# EAGLE design LED (EAGLE 9.6.2)
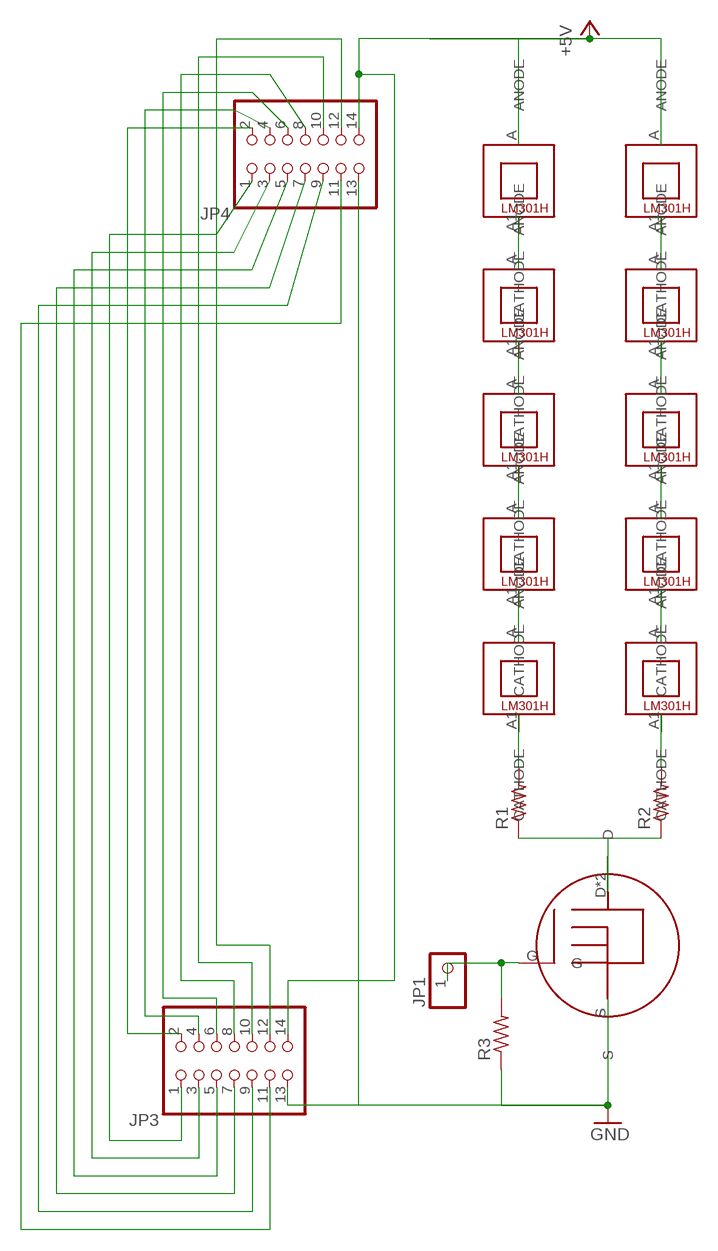
[diagram p0: schematic, sheet 1]

## Parts
JP1  PINHD-1X1  [1X01]
JP3  PINHD-2X7  [2X07]
JP4  PINHD-2X7  [2X07]
R1  FLIPFLOP-RES  [0805-THM]
R2  FLIPFLOP-RES  [0805-THM]
R3  FLIPFLOP-RES  [0805-THM]
U$1  LM301H  [SPMWHD32AMH5XAT5SL]
U$2  LM301H  [SPMWHD32AMH5XAT5SL]
U$3  LM301H  [SPMWHD32AMH5XAT5SL]
U$4  LM301H  [SPMWHD32AMH5XAT5SL]
U$5  LM301H  [SPMWHD32AMH5XAT5SL]
U$6  LM301H  [SPMWHD32AMH5XAT5SL]
U$7  LM301H  [SPMWHD32AMH5XAT5SL]
U$8  LM301H  [SPMWHD32AMH5XAT5SL]
U$9  LM301H  [SPMWHD32AMH5XAT5SL]
U$10  LM301H  [SPMWHD32AMH5XAT5SL]
U$11  SOT223  [S]

## Nets
_GND: R1.1 R2.1 U$11.D U$11.DKLEIN(D)
GND: JP3.13 JP4.13 R3.1 U$11.S
N$1: JP3.12 JP4.12
N$2: JP3.1 JP4.1
N$3: R2.2 U$10.A1(CATHODE)
N$4: U$9.A1(CATHODE) U$10.A(ANODE)
N$5: U$8.A1(CATHODE) U$9.A(ANODE)
N$6: U$7.A1(CATHODE) U$8.A(ANODE)
N$7: U$6.A1(CATHODE) U$7.A(ANODE)
N$8: R1.2 U$5.A1(CATHODE)
N$9: U$4.A1(CATHODE) U$5.A(ANODE)
N$10: U$3.A1(CATHODE) U$4.A(ANODE)
N$11: U$2.A1(CATHODE) U$3.A(ANODE)
N$12: U$1.A1(CATHODE) U$2.A(ANODE)
N$13: JP3.2 JP4.2
N$14: JP3.3 JP4.3
N$15: JP3.4 JP4.4
N$16: JP3.5 JP4.5
N$17: JP3.6 JP4.6
N$18: JP3.7 JP4.7
N$19: JP3.8 JP4.8
N$20: JP3.9 JP4.9
N$21: JP3.10 JP4.10
N$22: JP3.11 JP4.11
N$23: JP1.1 R3.2 U$11.G
VCC: JP3.14 JP4.14 U$1.A(ANODE) U$6.A(ANODE) ; supply symbol labelled +5V

## Library data of the parts
JP1 = pinhead:PINHD-1X1: PIN HEADER
JP3 JP4 = pinhead:PINHD-2X7: PIN HEADER
R1-R3 = adafruit:FLIPFLOP-RES: Flip Flop resistor An 0805 resistor inside a standard 1/4W 5% resistor. Makes for easy mods
U$1-U$10 = Samsung LEDs:LM301H
U$11 = FRUGT:SOT223

## Board
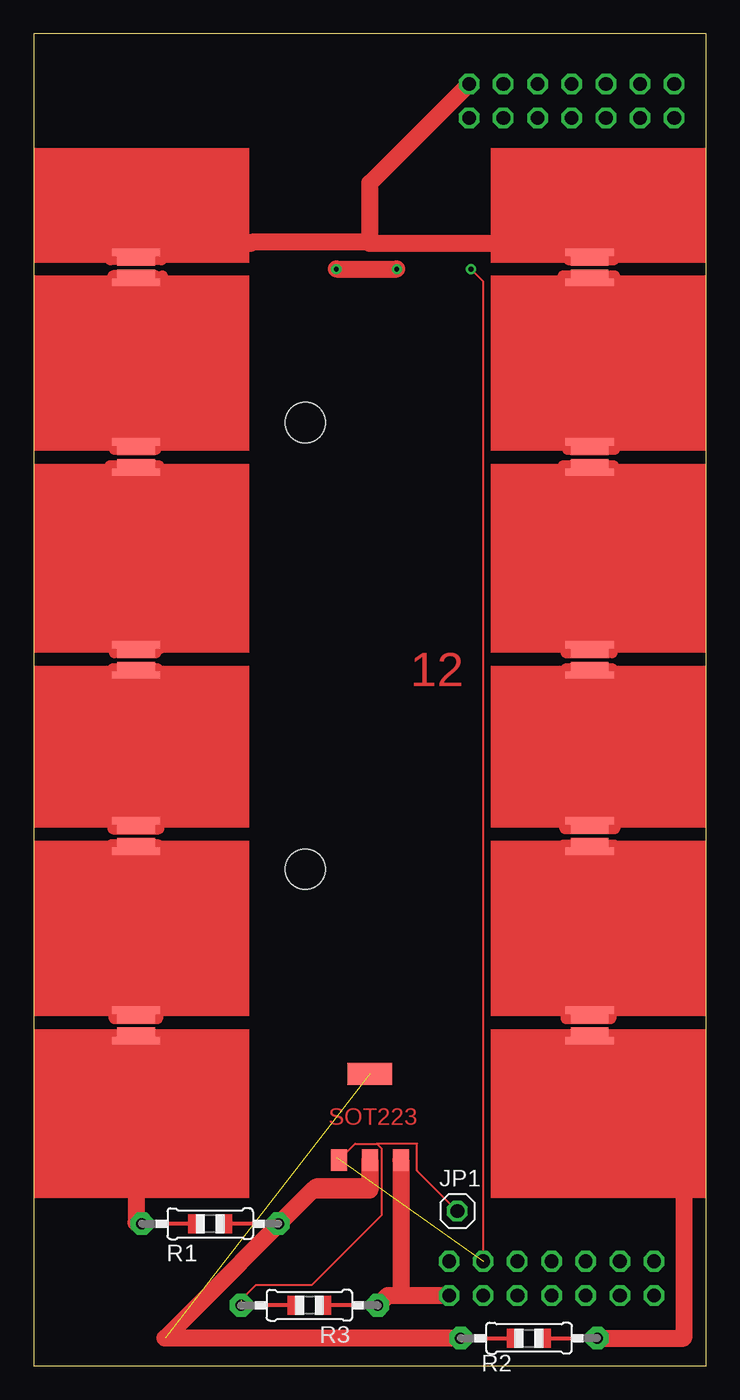
[diagram p1: board, top side]
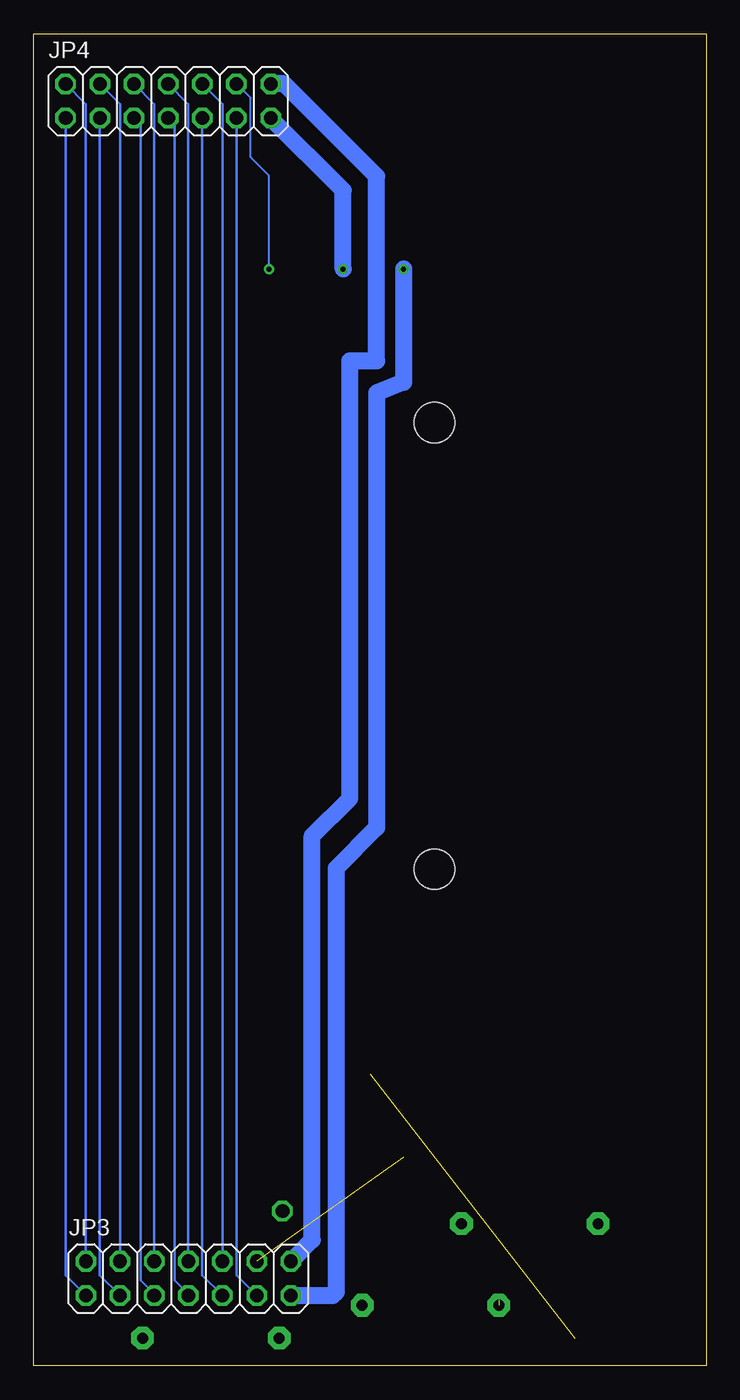
[diagram p2: board, bottom side, seen from below]

Size 50 x 99 mm. Coordinates in mm from the lower left corner, seen from the top.
Outline: 0,0 50,0 50,99 0,99 0,0
Copper layers (1*16): Top 0.035mm / dielectric 1.5mm / Bottom 0.035mm
Design rules "default": minimum track width 6mil, minimum drill 0.35mm, track to track 6mil, track to pad 6mil, pad to pad 6mil, via to via 6mil, smd to smd 6mil, copper to edge 40mil, drill to drill 6mil, minimum pad ring 10mil, minimum via ring 8mil, stop-mask expansion 4mil, vias tented up to drill 0mil, thermal gap 10mil
Holes 3 mm at 20.2,70.1 20.2,36.9

### Footprints (pad centres in the part's own frame; a part is rotated, then mirrored left to right if it is on the bottom)
1X01 = drill 1.016 octagon: 1 0,0
2X07 = drill 1.016 octagon: 1 -7.62,-1.27; 2 -7.62,1.27; 3 -5.08,-1.27; 4 -5.08,1.27; 5 -2.54,-1.27; 6 -2.54,1.27; 7 0,-1.27; 8 0,1.27; 9 2.54,-1.27; 10 2.54,1.27; 11 5.08,-1.27; 12 5.08,1.27; 13 7.62,-1.27; 14 7.62,1.27
0805-THM = drill 0.813 pad 1.676 octagon: 1 -5.08,0; 2 5.08,0
SPMWHD32AMH5XAT5SL = smd 3.6 x 0.55: A -3.81,2.475; A1 -3.81,0.23 | smd 2.8 x 0.7: B -3.81,1.85; B1 -3.81,0.85
S = smd 3.3 x 1.6: D -1,1.2 | smd 1.2 x 1.6: DKLEIN -1,-5.2; G -3.3,-5.2; S 1.3,-5.2

### Placement (x,y rotation side)
JP1  31.5,11.5 0 top
JP3  38.5,6.5 0 bottom
JP4  40,94 0 bottom
R1  13.12,10.56 180 top
R2  36.82,2.06 0 top
R3  20.5,4.5 180 top
U$1  11.43,80.27 0 top
U$2  11.43,66.19 0 top
U$3  11.43,51.11 0 top
U$4  11.43,38.03 0 top
U$5  11.43,23.95 0 top
U$6  45.13,80.27 0 top
U$7  45.13,66.19 0 top
U$8  45.13,51.11 0 top
U$9  45.13,38.03 0 top
U$10  45.13,23.95 0 top
U$11  26,20.5 0 top

### Tracks (layer width: path | path; a pad name or v marks a point on that pad's centre or on a via)
_GND  (1 unrouted)
  Top 0.152: R2.1 30.94,2.06
  Top 1.27: R1.1 20.7,13.06 25,13.06 U$11.DKLEIN 25,13.3 21,13.3 9.76,2.06 R2.1
GND  (via drill 0.35)
  Top 1.27: U$11.S 27.3,5.23 | 27.3,5.23 JP3.13 | v22.5,81.5 v27,81.5 | R3.1 26.31,5.23 27.3,5.23
  Bottom 1.27: JP3.13 27.77,5.23 27.5,5.5 27.5,37 24.5,40 24.5,72.3 22.5,73.1 v22.5,81.5 | v27,81.5 27,87.35 JP4.13
N$1  (via drill 0.35)  (1 unrouted)
  Top 0.152: 22.5,16 22.5,15.5 | JP3.12 33.42,80.58 v32.5,81.5
  Bottom 0.152: JP4.12 33.87,94.22 33.87,89.82 32.5,88.45 v32.5,81.5
N$2
  Bottom 0.2: JP3.1 47.62,6.73 JP4.1
N$3
  Top 0.813: U$10.A1 41.32,24.6 42.9,24.6 42.9,24 39.4,24 39.4,24.6 40.9,24.6 | R2.2 48.53,2.06 48.53,14.87 40.61,14.87 40.61,13.3
  Top 1.27: U$10.A1 48.32,17.18 48.32,2.06 R2.2
N$4
  Top 0.813: U$9.A1 41.32,37.9 39.36,37.9 39.36,38.7 43.2,38.7 43.2,37.8 41.6,37.8 | U$10.A 42.9,26.42 42.9,25.8 39.6,25.8 39.6,26.7 43.3,26.7
  Top 1.27: U$9.A1 U$10.A
N$5
  Top 0.813: 41.32,51.2 43,51.2 43,51.8 39.6,51.8 39.6,51.2 41.32,51.2 | 41.32,51.2 U$8.A1 | U$9.A 41.32,39.9 39.5,39.9 39.5,40.7 41.5,40.7 43.2,40.7 43.2,39.9 41.4,39.9
  Top 1.27: U$8.A1 41.32,40.88 41.5,40.7
N$6
  Top 0.813: U$7.A1 42.8,66.42 42.8,66.9 43.1,66.9 43.1,66 39.36,66 39.36,66.9 39.9,66.9 | U$8.A 39.8,53.59 39.8,53 39.6,53 39.6,53.8 43,53.8 43,53 42.7,53
  Top 1.27: U$7.A1 U$8.A
N$7
  Top 0.813: U$6.A1 42.9,80.5 42.9,81 43.2,81 43.2,80 39.36,80 39.36,81 39.9,81 | U$7.A 41.32,68.1 39.7,68.1 39.7,68.8 41.5,68.8 43.2,68.8 43.2,68.1 41.6,68.1
  Top 1.27: U$6.A1 41.32,68.98 41.5,68.8
N$8
  Top 0.813: U$5.A1 5.7,24.18 5.7,24.6 9.4,24.6 9.4,23.9 5.8,23.9 | R1.2 7.8,10.79 7.8,14.9 6.8,14.9 6.8,13.2 6.91,13.2 6.91,14.87 8.33,14.87 8.33,13.2
  Top 1.27: R1.2 7.62,10.65 U$5.A1
N$9
  Top 0.813: U$4.A1 9.3,38.26 9.3,38.7 5.7,38.7 5.7,37.9 9.4,37.9 | U$5.A 9.2,26.42 9.2,25.8 6,25.8 6,26.7 9.5,26.7
  Top 1.27: U$4.A1 U$5.A
N$10
  Top 0.813: U$3.A1 9.2,51.34 9.2,51.8 5.9,51.8 5.9,51 9.2,51 | U$4.A 5.9,40.51 5.9,39.9 9.3,39.9 9.3,40.8 5.9,40.8
  Top 1.27: U$3.A1 U$4.A
N$11
  Top 0.813: U$2.A1 9.1,66.42 9.1,66.9 9.3,66.9 9.3,66 5.66,66 5.66,66.9 6.2,66.9 | U$3.A 9.1,53.59 9.1,53 6,53 6,53.8 9.4,53.8 9.4,53.3
  Top 1.27: U$2.A1 U$3.A
N$12
  Top 0.813: 5.9,80.5 5.9,81 9.1,81 9.1,80.5 U$1.A1 5.9,80.5 | 5.9,80.5 5.9,80.1 9.58,80.1 9.58,81 | U$2.A 9.1,68.67 9.1,68.1 6,68.1 6,69 9.58,69 9.58,68.6
  Top 1.27: U$1.A1 U$2.A
N$13
  Bottom 0.2: JP3.2 46.12,93.77 JP4.2
N$14
  Bottom 0.2: JP3.3 45.08,6.73 JP4.3
N$15
  Bottom 0.2: JP3.4 43.58,93.77 JP4.4
N$16
  Bottom 0.2: JP3.5 41.04,5.34 42.05,6.35 42.05,92.24 JP4.5
N$17
  Bottom 0.2: JP3.6 41.04,93.77 JP4.6
N$18
  Bottom 0.2: JP3.7 38.5,5.34 39.51,6.35 39.51,92.24 JP4.7
N$19
  Bottom 0.2: JP3.8 38.5,93.77 JP4.8
N$20
  Bottom 0.2: JP3.9 37.46,6.73 JP4.9
N$21
  Bottom 0.2: JP3.10 35.96,93.77 JP4.10
N$22
  Bottom 0.2: JP3.11 34.92,6.73 JP4.11
N$23  (1 unrouted)
  Top 0.152: U$11.G 23.9,16.5 25.52,16.5 | 25.52,16.5 25.86,16.16 25.86,11.2 20.66,6 16.5,6 15.42,4.92 15.42,4.88 | JP1.1 28.5,14.5 28.5,16.5 25.52,16.5
VCC
  Top 0.152: 5.8,83.1 5.8,82.75 | 5.8,82.3 5.7,82.3 | 5.7,83.1 5.8,83.1 | 5.8,83.1 7,83.1 | 16.1,83.4 8.28,83.4 U$1.A
  Top 0.813: U$1.A 5.7,82.75 | U$1.A 5.8,82.75 5.8,82.3 | U$1.A 8.9,82.75 8.9,82.2 | 8.9,82.2 9.5,82.2 9.5,82.75 | 8.9,82.2 5.7,82.2 5.7,82.3 5.7,83.1 7,83.1 9.5,83.1 9.5,82.75 | U$1.A 9.5,82.75 | U$6.A 39.8,82.75 39.8,82.2 43.1,82.2 43.1,83 41.5,83 39.4,83 39.4,82.5 | 25,83.5 25,83.4
  Top 1.27: 25,83.5 16.2,83.5 16.1,83.4 7.3,83.4 7,83.1 | 41.5,83 41.1,83.4 25,83.4 25,87.89 JP4.14
  Bottom 1.27: JP3.14 29.29,9.36 29.29,39.39 26.5,42.18 26.5,74.69 24.5,74.69 24.5,88.39 31.38,95.27 JP4.14
(copper drawn outside any net)
  shapes: Top area x21

### Text on the board
Top: 12